# Altium schematic sheet power.SchDoc
size A
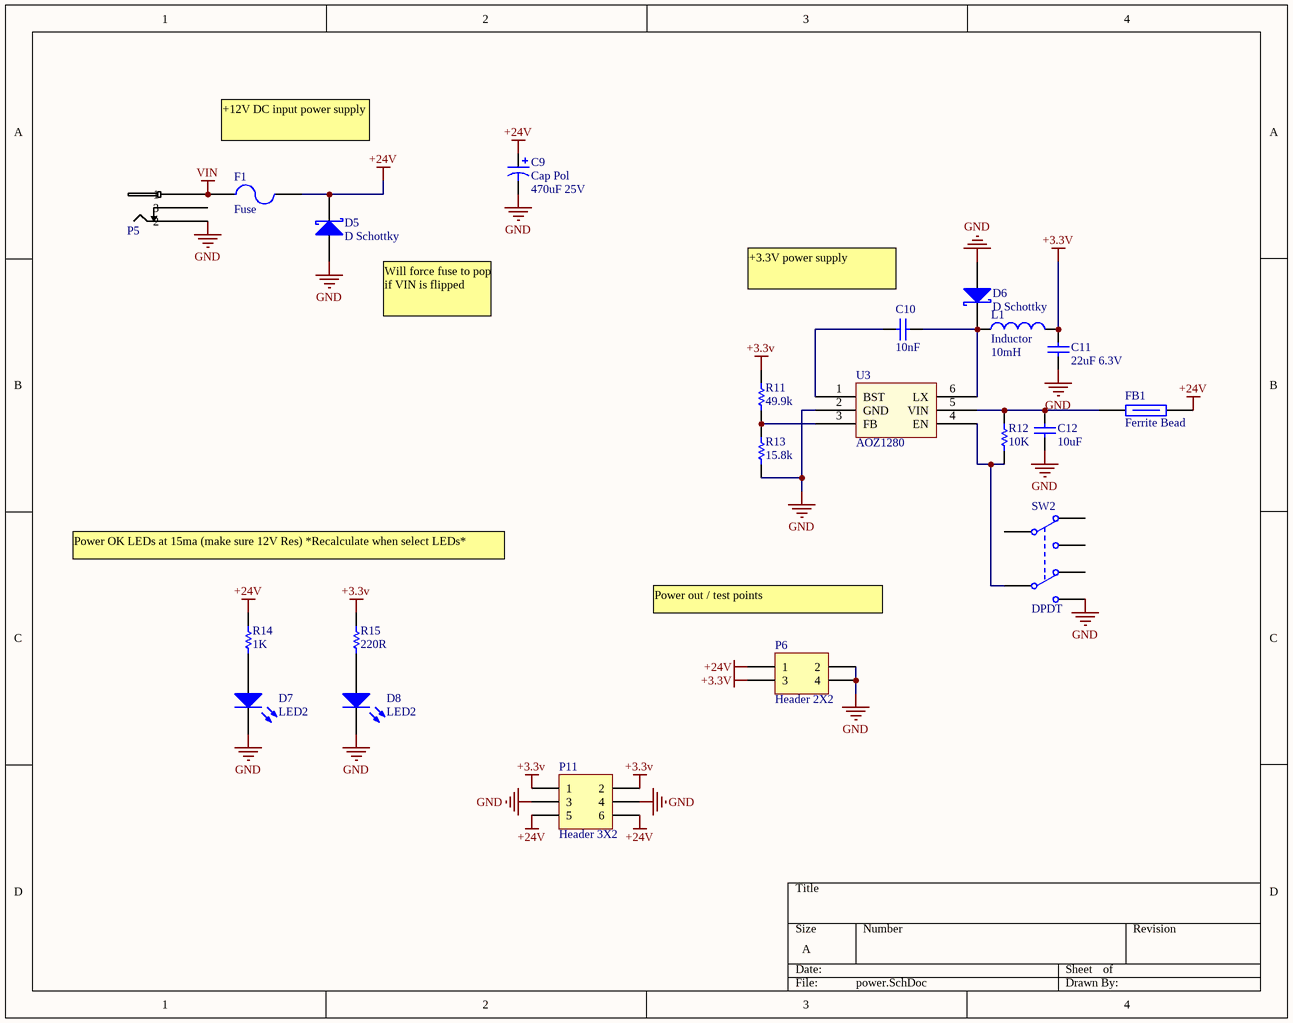
[diagram p0: power.SchDoc]

## Parts
C9  Cap Pol  value 470uF 25V  [Capacitor Nichi CL 10x10]
C10  value 10nF  [1608[0603]]  (hidden comment: Cap)
C11  value 22uF 6.3V  [CAPC2012L-3D]  (hidden comment: Cap)
C12  value 10uF  [CAPC2012L-3D]  (hidden comment: Cap)
D5  D Schottky  [DO-214-AA]
D6  D Schottky  [DO-214-AA]
D7  LED2  [LED 0805]
D8  LED2  [LED 0805]
F1  Fuse  [Fuse Holder]
FB1  Ferrite Bead  [0603]
L1  Inductor  value 10mH  [Inductor 5020]
P5  power_jack  [PowerJack]  (value not drawn)
P6  Header 2X2  [HDR2X2]
P11  Header 3X2  [HDR2X3]
R11  value 49.9k  [J1-0603]  (hidden comment: Res)
R12  value 10K  [J1-0603]  (hidden comment: Res)
R13  value 15.8k  [J1-0603]  (hidden comment: Res)
R14  value 1K  [J1-0603]  (hidden comment: Res)
R15  value 220R  [J1-0603]  (hidden comment: Res)
SW2  DPDT  [MCLSS22]
U3  AOZ1280  [SOT23-6]

## Nets
+3.3v: C11.2 L1.2 P6.3 P11.1 P11.2 R11.2 R15.2
+24V: C9.2 D5.2(K) F1.2 FB1.2 P6.1 P11.5 P11.6 R14.2
GND: C9.1 C11.1 C12.1 D5.1(A) D6.1(A) D7.2(K) D8.2(K) P5.2 P6.2 P6.4 P11.3 P11.4 R13.1 SW2.6(NO2) U3.2(GND)
VIN: F1.1 P5.1
NetC10_1: C10.1 U3.1(BST)
NetC10_2: C10.2 D6.2(K) L1.1 U3.6(LX)
NetC12_2: C12.2 FB1.1 R12.2 U3.5(VIN)
NetD7_1: D7.1(A) R14.1
NetD8_1: D8.1(A) R15.1
NetR11_1: R11.1 R13.2 U3.3(FB)
NetR12_1: R12.1 SW2.5(COMMON2) U3.4(EN)

Not connected (* = marked no-connect by the designer): P5 3; SW2 1(NC1) 2(COMMON1) 3(NO1) 4(NC2)

## Notes on the sheet
- +12V DC input power supply
- (near C10) +3.3V power supply
- Will force fuse to pop if VIN is flipped
- Power OK LEDs at 15ma (make sure 12V Res) *Recalculate when select LEDs*
- Power out / test points

## Library data of the parts
C9 = Cap Pol: Polarized Capacitor (Axial); Published: 8-Jun-2000; LatestRevisionDate: 17-Jul-2002; LatestRevisionNote: Re-released for DXP Platform.; PackageReference: POLAR0.8; Publisher: Altium Limited; PackageDescription: Polarized Capacitor; 2 Leads
C10-C12 = Cap: Capacitor; Published: 8-Jun-2000; LatestRevisionDate: 17-Jul-2002; LatestRevisionNote: Re-released for DXP Platform.; PackageReference: RAD-0.3; Publisher: Altium Limited; PackageDescription: Radial Cap, Thru-Hole; 2 Leads; 0.3 in Pin Spacing
D5 D6 = D Schottky: Schottky Diode; Published: 8-Jun-2000; LatestRevisionDate: 17-Jul-2002; LatestRevisionNote: Re-released for DXP Platform.; PackageReference: SMB; Publisher: Altium Limited; PackageDescription: DO-214-AA/SMB; 2 C-Bend Leads; Body 5.3 x 3.6 mm, inc. leads (LxW); Code_JEDEC: DO-214-AA
D7 D8 = LED2: Typical RED, GREEN, YELLOW, AMBER GaAs LED; Published: 8-Jun-2000; LatestRevisionDate: 17-Jul-2002; LatestRevisionNote: Re-released for DXP Platform.; PackageVersion: Feb-2002; PackageReference: 3.2X1.6X1.1; Publisher: Altium Limited; PackageDescription: SM LED; 2 Flat Leads
L1 = Inductor: Code_IEC: 1005; Published: 8-Jun-2000; LatestRevisionDate: 29-May-2009; LatestRevisionNote: IPC-7351 Footprint Added.; PackageReference: 0402-A; Publisher: Altium Limited; PackageDescription: Chip Inductor; Code_JEITA: 0402
P6 = Header 2X2: Header, 2-Pin, Dual row; LatestRevisionDate: 17-Jul-2002; LatestRevisionNote: Re-released for DXP Platform.; Publisher: Altium Limited
P11 = Header 3X2: Header, 3-Pin, Dual row; LatestRevisionDate: 17-Jul-2002; LatestRevisionNote: Re-released for DXP Platform.; Publisher: Altium Limited
R11-R15 = Res: Resistor 0805; Published: 8-Jun-2000; LatestRevisionDate: 17-Jul-2002; LatestRevisionNote: Re-released for DXP Platform.; PackageReference: AXIAL-0.3; Publisher: Altium Limited; PackageDescription: Axial Device, Thru-Hole; 2 Leads; 0.3 in Pin Spacing
SW2 = DPDT: Switch; Published: 24-Mar-1999; LatestRevisionDate: 29-May-2009; LatestRevisionNote: IPC-7351 Footprint Added.; PackageVersion: Mar-2001; PackageReference: SOT23-6; Publisher: Altium Limited; PackageDescription: 6-Pin SOT-23 Package 0.95 mm Pitch, 2.7 mm Lead Span; Code_JEITA: SC-74; Code_IPC: SOT26A-6
F1 = Fuse: Published: 8-Jun-2000; LatestRevisionDate: 17-Jul-2002; LatestRevisionNote: Re-released for DXP Platform.; PackageReference: PIN-W2/E2.8; Publisher: Altium Limited; PackageDescription: Thru-Hole; 2 Leads